# Altium schematic sheet Interface.SchDoc
size Letter
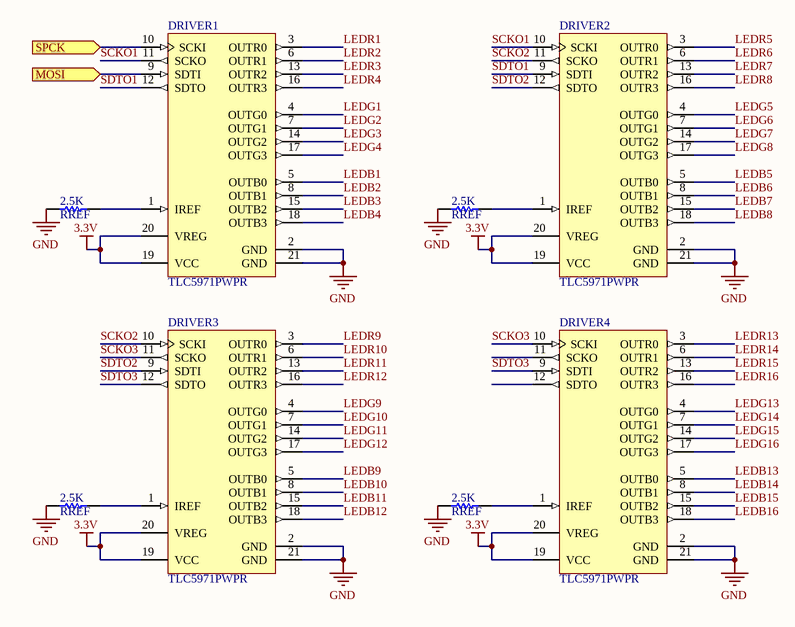
[diagram p0: Interface.SchDoc]

## Parts
DRIVER1  TLC5971PWPR  [TI-PWP20-2965X2290TP_N]
DRIVER2  TLC5971PWPR  [TI-PWP20-2965X2290TP_N]
DRIVER3  TLC5971PWPR  [TI-PWP20-2965X2290TP_N]
DRIVER4  TLC5971PWPR  [TI-PWP20-2965X2290TP_N]
R1  RREF  value 2.5K  [AXIAL-0.3]
R2  RREF  value 2.5K  [AXIAL-0.3]
R3  RREF  value 2.5K  [AXIAL-0.3]
R4  RREF  value 2.5K  [AXIAL-0.3]

## Ports
MOSI (in), SPCK (in)

## Nets
3.3V: DRIVER1.19(VCC) DRIVER1.20(VREG) DRIVER2.19(VCC) DRIVER2.20(VREG) DRIVER3.19(VCC) DRIVER3.20(VREG) DRIVER4.19(VCC) DRIVER4.20(VREG)
GND: DRIVER1.2(GND) DRIVER1.21(GND) DRIVER2.2(GND) DRIVER2.21(GND) DRIVER3.2(GND) DRIVER3.21(GND) DRIVER4.2(GND) DRIVER4.21(GND) R1.1 R2.1 R3.1 R4.1
LEDB1: DRIVER1.5(OUTB0)
LEDB2: DRIVER1.8(OUTB1)
LEDB3: DRIVER1.15(OUTB2)
LEDB4: DRIVER1.18(OUTB3)
LEDB5: DRIVER2.5(OUTB0)
LEDB6: DRIVER2.8(OUTB1)
LEDB7: DRIVER2.15(OUTB2)
LEDB8: DRIVER2.18(OUTB3)
LEDB9: DRIVER3.5(OUTB0)
LEDB10: DRIVER3.8(OUTB1)
LEDB11: DRIVER3.15(OUTB2)
LEDB12: DRIVER3.18(OUTB3)
LEDB13: DRIVER4.5(OUTB0)
LEDB14: DRIVER4.8(OUTB1)
LEDB15: DRIVER4.15(OUTB2)
LEDB16: DRIVER4.18(OUTB3)
LEDG1: DRIVER1.4(OUTG0)
LEDG2: DRIVER1.7(OUTG1)
LEDG3: DRIVER1.14(OUTG2)
LEDG4: DRIVER1.17(OUTG3)
LEDG5: DRIVER2.4(OUTG0)
LEDG6: DRIVER2.7(OUTG1)
LEDG7: DRIVER2.14(OUTG2)
LEDG8: DRIVER2.17(OUTG3)
LEDG9: DRIVER3.4(OUTG0)
LEDG10: DRIVER3.7(OUTG1)
LEDG11: DRIVER3.14(OUTG2)
LEDG12: DRIVER3.17(OUTG3)
LEDG13: DRIVER4.4(OUTG0)
LEDG14: DRIVER4.7(OUTG1)
LEDG15: DRIVER4.14(OUTG2)
LEDG16: DRIVER4.17(OUTG3)
LEDR1: DRIVER1.3(OUTR0)
LEDR2: DRIVER1.6(OUTR1)
LEDR3: DRIVER1.13(OUTR2)
LEDR4: DRIVER1.16(OUTR3)
LEDR5: DRIVER2.3(OUTR0)
LEDR6: DRIVER2.6(OUTR1)
LEDR7: DRIVER2.13(OUTR2)
LEDR8: DRIVER2.16(OUTR3)
LEDR9: DRIVER3.3(OUTR0)
LEDR10: DRIVER3.6(OUTR1)
LEDR11: DRIVER3.13(OUTR2)
LEDR12: DRIVER3.16(OUTR3)
LEDR13: DRIVER4.3(OUTR0)
LEDR14: DRIVER4.6(OUTR1)
LEDR15: DRIVER4.13(OUTR2)
LEDR16: DRIVER4.16(OUTR3)
MOSI: DRIVER1.9(SDTI) ; port MOSI
SCKO1: DRIVER1.11(SCKO) DRIVER2.10(SCKI)
SCKO2: DRIVER2.11(SCKO) DRIVER3.10(SCKI)
SCKO3: DRIVER3.11(SCKO) DRIVER4.10(SCKI)
SDTO1: DRIVER1.12(SDTO) DRIVER2.9(SDTI)
SDTO2: DRIVER2.12(SDTO) DRIVER3.9(SDTI)
SDTO3: DRIVER3.12(SDTO) DRIVER4.9(SDTI)
SPCK: DRIVER1.10(SCKI) ; port SPCK
NetDRIVER1_1: DRIVER1.1(IREF) R1.2
NetDRIVER2_1: DRIVER2.1(IREF) R2.2
NetDRIVER3_1: DRIVER3.1(IREF) R3.2
NetDRIVER4_1: DRIVER4.1(IREF) R4.2

Not connected (* = marked no-connect by the designer): DRIVER4 11(SCKO) 12(SDTO)

## Library data of the parts
DRIVER1-DRIVER4 = TLC5971PWPR: 12-Channel, 16-Bit ES-PWM RGB LED Driver with 3.3 V Linear Regulator, 6 to 17 V, -40 to 85 degC, 20-pin SOP (PWP20), Green (RoHS & no Sb/Br); Manufacturer: Texas Instruments; Rating: Catalog; Vin(Max)(V): 17; Vin(Min)(V): 6; DatasheetVersion: SBVS146C; PackageVersion: 4073225-4/I; PackageReference: PWP20-2965X2290TP; PackageDescription: 20-Lead, Plastic Small Outline, Body Size 4.4 x 6.5 mm, Pitch 0.65 mm; Supplier 1: Digi-Key; Supplier Part Number 1: 296-27796-2-ND; Supplier 2: Digi-Key; Supplier Part Number 2: 296-27796-1-ND; Supplier 3: Digi-Key; Supplier Part Number 3: 296-27796-6-ND; Supplier 4: Newark; Supplier Part Number 4: 01T0730; Supplier 5: Mouser; Supplier Part Number 5: 595-TLC5971PWPR; Eco-Plan: Green (RoHS & no Sb/Br); SubFamily: LED Driver; Mounting Technology: Surface Mount; Code_JEDEC: MO-153; PartNumber: TLC5971PWPR; ComponentLink1Description: Manufacturer URL; ComponentLink1URL: http://www.ti.com/; ComponentLink2Description: Datasheet; ComponentLink2URL: http://www.ti.com/general/docs/lit/getliterature.tsp?genericPartNumber=TLC5971&fileType=pdf; ComponentLink3Description: Package Specification; ComponentLink3URL: http://www.ti.com/litv/pdf/mhts001g
R1-R4 = Res1: Resistor; Published: 8-Jun-2000; LatestRevisionDate: 17-Jul-2002; LatestRevisionNote: Re-released for DXP Platform.; PackageReference: AXIAL-0.3; Publisher: Altium Limited; PackageDescription: Axial Device, Thru-Hole; 2 Leads; 0.3 in Pin Spacing